# Altium schematic sheet 1_CMPower.SchDoc
size Letter
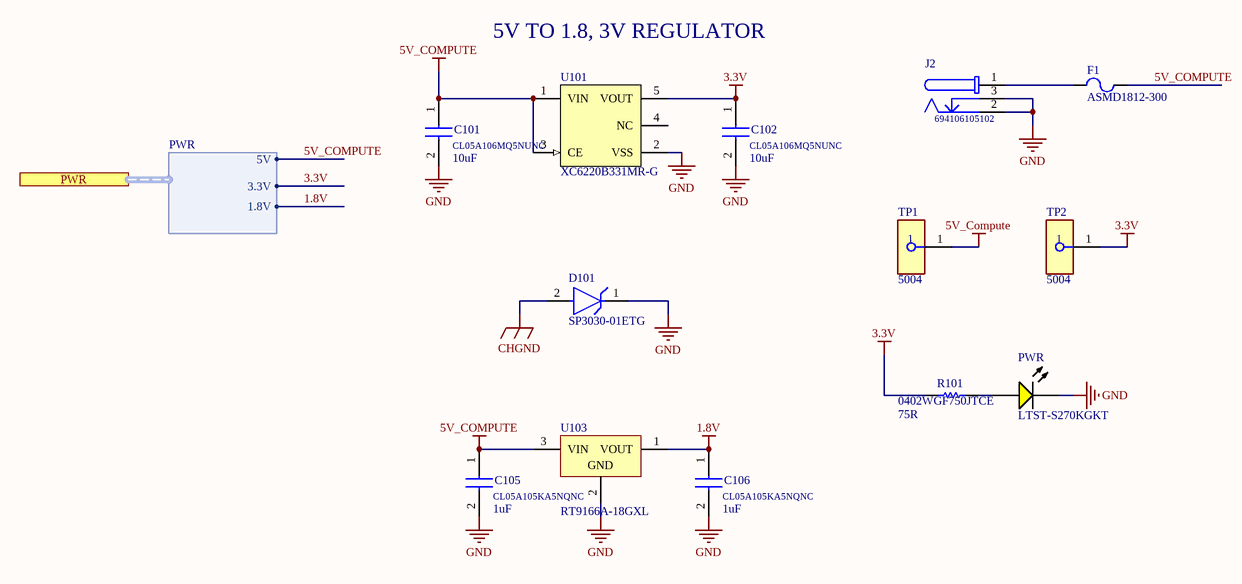
[diagram p0: 1_CMPower.SchDoc]

## Parts
C101  CL05A106MQ5NUNC  value 10uF  [CAPC1005X55N]
C102  CL05A106MQ5NUNC  value 10uF  [CAPC1005X55N]
C105  CL05A105KA5NQNC  value 1uF  [CAPC1005X55N]
C106  CL05A105KA5NQNC  value 1uF  [CAPC1005X55N]
D101  SP3030-01ETG  [FP-SP3030-MFG]
F1  ASMD1812-300  [LFUS-FUSE1812-71_V]
J2  694106105102  [694106105102]
PWR  LTST-S270KGKT  [AVAG-HSMX-C190_V]
R101  0402WGF750JTCE  [RESC1005X40X25ML05T10]
TP1  5004  [FP-5004-MFG]
TP2  5004  [FP-5004-MFG]
U101  XC6220B331MR-G  [TORX-SOT-25-5_M]
U103  RT9166A-18GXL  [SOT-89_N]

## Ports
PWR (harness PWR)

## Harnesses
PWR: 5V, 3.3V, 1.8V

## Nets
1.8V: C106.1 U103.1(VOUT) ; port PWR.1.8V
3.3V: C102.1 R101.2 TP2.1 U101.5(VOUT) ; port PWR.3.3V
5V_COMPUTE: C101.1 C105.1 F1.2 TP1.1 U101.1(VIN) U101.3(CE) U103.3(VIN) ; port PWR.5V
CHGND: D101.2(A)
GND: C101.2 C102.2 C105.2 C106.2 D101.1(C) J2.2 J2.3 PWR.2(K) U101.2(VSS) U103.2(GND)
NetF1_1: F1.1 J2.1
NetPWR_1: PWR.1(A) R101.1

Not connected (* = marked no-connect by the designer): U101 4(NC)

## Notes on the sheet
- 5V TO 1.8, 3V REGULATOR
- (near R101) 75R

## Library data of the parts
C101 C102 = C0402C560K5RACTU: 10uF 0402; Manufacturer_Name: Kemet; Datasheet Link: https://content.kemet.com/datasheets/KEM_C1002_X7R_SMD.pdf; Height: 0.55mm; Manufacturer_Part_Number: C0402C560K5RACTU; Arrow Part Number: C0402C560K5RACTU; Mouser Part Number: 80-C0402C560K5RACTU; Mouser Price/Stock: https://www.mouser.co.uk/ProductDetail/KEMET/C0402C560K5RACTU?qs=gt1LBUVyoHmQZW5v3ySgNQ%3D%3D
C105 C106 = C0402C560K5RACTU: 1uF 0402; Manufacturer_Name: Kemet; Datasheet Link: https://content.kemet.com/datasheets/KEM_C1002_X7R_SMD.pdf; Height: 0.55mm; Manufacturer_Part_Number: C0402C560K5RACTU; Arrow Part Number: C0402C560K5RACTU; Mouser Part Number: 80-C0402C560K5RACTU; Mouser Price/Stock: https://www.mouser.co.uk/ProductDetail/KEMET/C0402C560K5RACTU?qs=gt1LBUVyoHmQZW5v3ySgNQ%3D%3D
D101 = CMP-08607-000070-1: TVS DIODE 5V 10V SOD882; Manufacturer: Littelfuse; Max Junction Temp: +150°C; Automotive Grade: Grade 1; Direction: Unidirectional; Peak Pulse Current: 3A; Capacitance: 0.5pF; Value: 0.5pF; Number Of Channels: 1; Manufacturer Part Number: SP3030-01ETG; Temperature Range Low: -40°C; Lead Free: Yes; Package: SP3030; Device Class L2: TVS Diodes; Height: 0.6mm; ComponentLink2URL: https://www.littelfuse.com/~/media/electronics/datasheets/tvs_diode_arrays/littelfuse_tvs_diode_array_sp3030_datasheet.pdf.pdf; Device Class L3: unset; Category: Diode; Reverse Standoff Voltage: 5V; RoHS: TRUE; Digikey Description: TVS DIODE 5V 10V SOD882; Octopart: https://octopart.com/sp3030-01etg-littelfuse-29687287; ComponentLink2Description: Datasheet; Device Class L1: Circuit Protection; Automotive: Yes; Temperature: -40°C to +125°C; Temperature Range High: +125°C; Clamping Voltage: 10V; Mouser Description: TVS Diodes / ESD Suppressors 5V 1uA 22kV UNIDIRECTIONAL
F1 = CMP-0257-00001-1: Resettable PTC, 1812, 3 A Ihold, 5 A Itrip, 8V max; PartNumber: 1812L150ZR; Itrip: 3 A; Vmax: 8 Vdc; Ihold: 1.5 A; Imax: 100 A; PackageReference: FUSE1812-71; ComponentLink1Description: Manufacturer URL; DatasheetVersion: 6/2012; ComponentLink2URL: http://www.littelfuse.com/products/resettable-ptcs/surface-mount/1812l/~/media/Electronics_Technical/Datasheets/Resettable_PTCs/Littelfuse_PTC_1812L_Datasheet.pdf; PackageVersion: 6/2012; PackageDescription: 2-Pin SMT Fuse, 4.55 x 3.24 mm Body; ComponentLink1URL: http://www.littelfuse.com/; ComponentLink2Description: Datasheet
J2 = CMP-1502-00176-1: DC Power Jack Connector with Pegs WR-DC, Male, Right Angled, SMT, 5 A, 24 V; Manufacturer: Wurth Elektronik; Plug Outer Diameter: 5.5mm; Opening Diameter: 6.4mm; Plug Inner Diameter: 2.05mm; Rated Current: 5A; Working Voltage: 24V; Publisher: WurthElektronik; Operating Temperature: -40to85degC; Packaging: TapeandReel; Part Number: 694106105102; Manufacturer URL: http://www.we-online.de; Mounting Technology: SMT; Gender: Male; Package Reference: 694106105102; Datasheet URL: http://katalog.we-online.de/em/datasheet/6941xx105102.pdf; Orientation: RightAngled
PWR = CMP-1744-00003-1: LED Uni-Color Yellow, 65 mW, 20 mA, -40 to 85 degC, 2-Pin SMD, RoHS, Tape and Reel; Tolerance: 1%; Voltage Rating: 50 V; Power Rating: 100 mW; Case\Package: 0603; Resistance: 390 Ohm; Min Operating Temperature: -55 degC; Length: 1.6 mm; ComponentLink3Description: Package Specification; Mount: Surface Mount; PackageReference: HSMX-C190; ComponentLink2Description: Datasheet; DatasheetVersion: Mar-12; Case Code (Metric): 1608; Pins: 2; Package Quantity: 5000; ComponentLink2URL: http://docs.avagotech.com/docs/AV02-0551EN; ComponentLink1Description: Manufacturer URL; RoHSCompliant: true; Packaging: Tape and Reel; PackageDescription: 2-Pin Surface Mount Device, Body 1.6 x 0.8 mm, Height 0.9 mm; REACH SVHC: No SVHC; ComponentLink3URL: http://www.fairchildsemi.com/dwg/MA/MA03D.pdf; Voltage Rating (DC): 50 V; Width: 0.8 mm; ComponentLink1URL: http://www.avagotech.com/; Max Operating Temperature: 155 degC; Case Code (Imperial): 0603; Height: 0.45 mm
R101 = CMP-2002-07344-1: 75R 0402; Part Number: RC0402FR-07100RL; Manufacturer: Yageo / Phycomp
TP1 TP2 = CMP-2000-05575-2: PC TEST POINT MINIATURE YELLOW; Manufacturer: Keystone; Number Of Contacts: 1; Is Female: yes; Device Class L1: Connectors; Manufacturer Part Number: 5004; Digikey Description: PC TEST POINT MINIATURE YELLOW; ComponentLink2URL: https://www.keyelco.com/product-pdf.cfm?p=1313; Lead Free: Yes; ComponentLink2Description: Datasheet; Category: Conn; Height: 4.72mm; Octopart: https://octopart.com/5004-keystone-28591; Mouser Description: TEST POINT PC MINI .040"D YELLOW; Device Class L3: unset; Contact Material: Silver; Package: 5004; Automotive: No; Device Class L2: unset; RoHS: TRUE
U101 = CMP-0599-00001-2: 1A LDO Voltage Regulator with CL discharge, 3.3 V, 1000 mA, -45 to 85 degC, 5-Pin SOT-25, RoHS, Reel; Manufacturer: Torex; Output Voltage: 3.3 V; Maximum Output Current: 1000 mA; ComponentLink1Description: Manufacturer URL; ComponentLink2URL: http://www.torex.co.jp/english/products/voltage_regulators/data/XC6220.pdf; DatasheetVersion: ETR0341-010a; ComponentLink1URL: http://www.torex.co.jp/; Mounting Technology: Surface Mount; Operating Ambient Temperature: -40 to 85 degC; PackageReference: SOT-25-5; PackageDescription: 5-Pin Small Out-Line Transistor, Body 2.9 x 1.65 mm, Pitch 0.95 mm; PartNumber: XC6220B331MR-G; RoHS: TRUE; Packing: Reel; ComponentLink2Description: Datasheet
U103 = CMP-0244-00406-1: Positive Voltage Regulator, 5V, 4-Pin SOT-89, Tape and Reel; PackageVersion: 2011; DatasheetVersion: 1/02/2011; PackageDescription: 3-Pin SOT-89 Package 1.5 mm Pitch, 4.1 mm Lead Span; PackageReference: SOT-89; ComponentLink2Description: Datasheet; ComponentLink1URL: http://www.st.com; ComponentLink1Description: Manufacturer URL; ComponentLink2URL: http://www.st.com/internet/com/TECHNICAL_RESOURCES/TECHNICAL_LITERATURE/DATASHEET/CD00000446.pdf